# Altium project volume_knob.PrjPcb
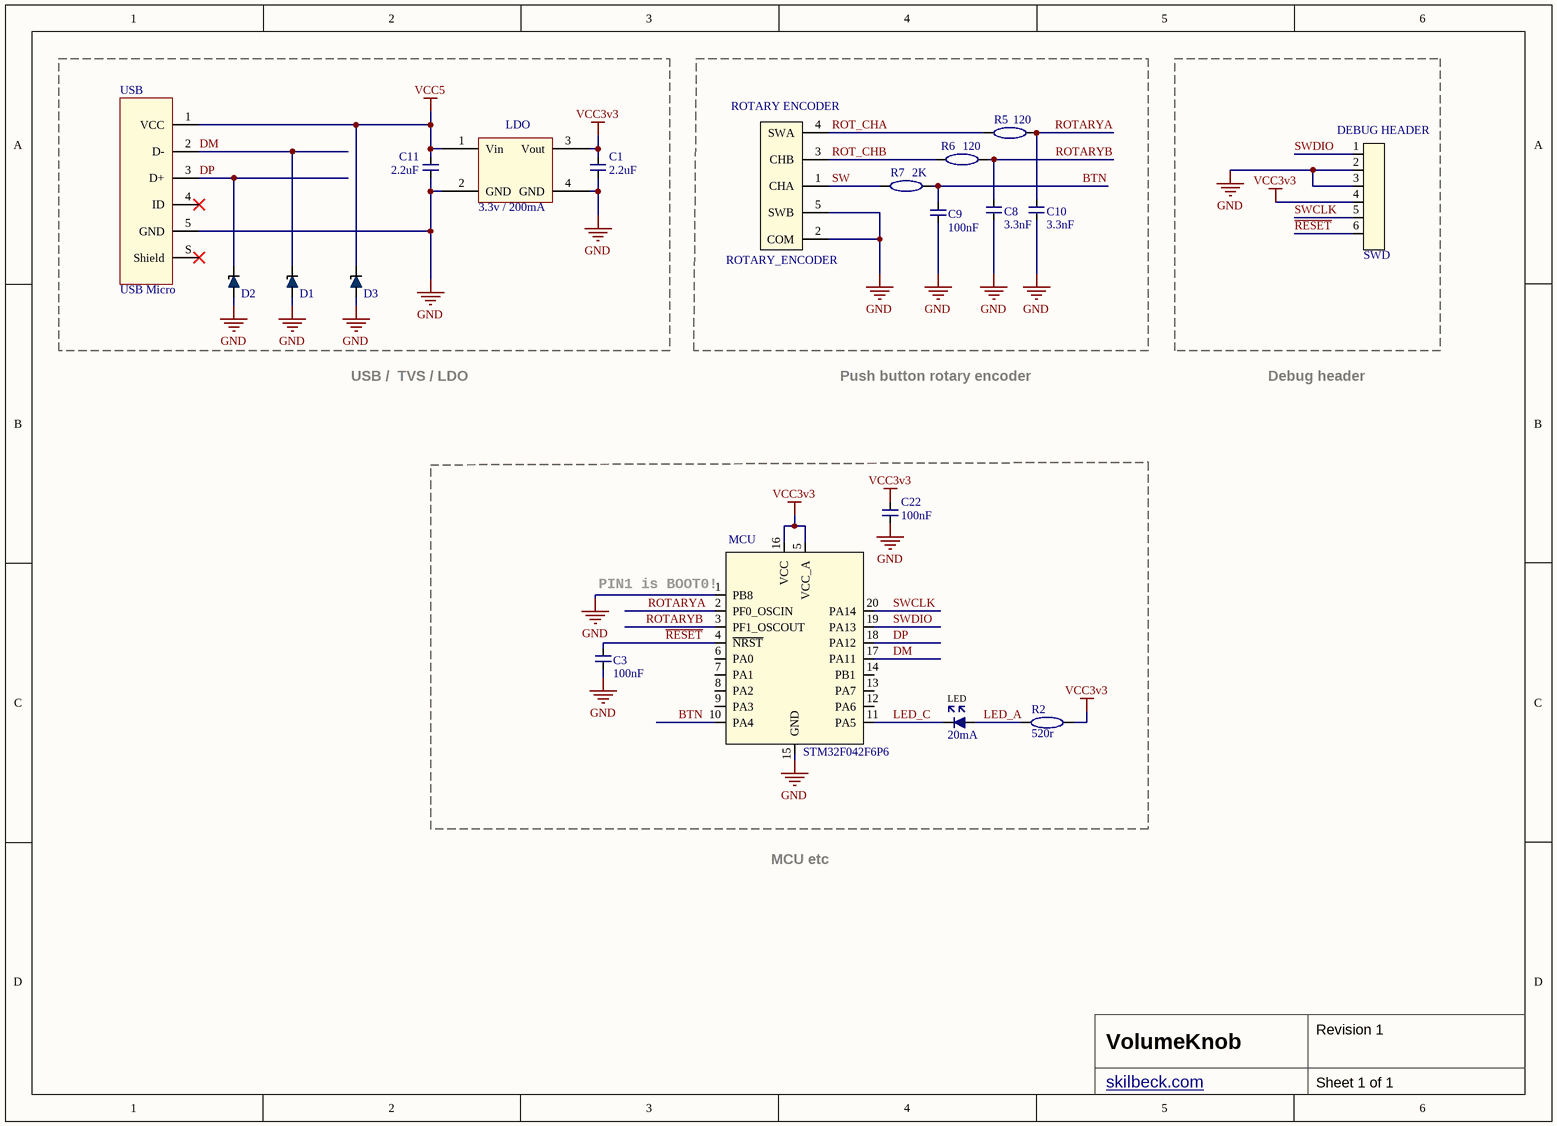
[diagram p0: volume_knob.SchDoc]
1 sheet, 20 parts. Net scope: global (net labels, ports and power ports of the same name join across sheets).
Board file: volume_knob.PcbDoc

## Sheet volume_knob.SchDoc: VolumeKnob
size 290 x 209 mm; Author: skilbeck.com; Revision: 1; SheetNumber: 1; SheetTotal: 1

### Parts
C1  2.2uF  [CAPC1608X07L]
C3  100nF  [CAPC1608X07L]
C8  3.3nF  [CAPC1608X07L]
C9  100nF  [CAPC1608X07L]
C10  3.3nF  [CAPC1608X07L]
C11  2.2uF  [CAPC1608X07L]
C22  100nF  [CAPC1608X07L]
D1  TVS_DIODE  [SODFL98X40-2L]  (value not drawn)
D2  TVS_DIODE  [SODFL98X40-2L]  (value not drawn)
D3  TVS_DIODE  [SODFL98X40-2L]  (value not drawn)
DEBUG_HEADER  SWD  [CON5]  (no BOM)
LDO  3.3v / 200mA  [SOT95P237X110-3L]
LED  20mA  [SMT_LED_0603]
MCU  STM32F042F6P6  [TSOP65P630X120-20L]
R2  520r  [RESC1608X05L]
R5  120  [RESC1608X05L]
R6  120  [RESC1608X05L]
R7  2K  [RESC1608X05L]
ROTARY_ENCODER  ROTARY_ENCODER  [ENCODER]
USB  USB Micro  [USB MICRO B]

### Blocks framed on the sheet
PIN1 is BOOT0!: C3 C22 LED MCU R2

### Nets
GND: C1.1(A) C3.1(A) C8.1(A) C9.1(A) C10.2(B) C11.1(A) C22.1(A) D1.2(A) D2.2(A) D3.2(A) DEBUG_HEADER.2 DEBUG_HEADER.3 LDO.2(GND) LDO.4(GND) MCU.1(PB8) MCU.15(GND) ROTARY_ENCODER.2(COM) ROTARY_ENCODER.5(SWB) USB.5(GND)
VCC3v3: C1.2(B) C22.2(B) DEBUG_HEADER.4 LDO.3(Vout) MCU.5(VCC_A) MCU.16(VCC) R2.2(B)
VCC5: C11.2(B) D3.1(K) LDO.1(Vin) USB.1(VCC)
~{RESET}: C3.2(B) DEBUG_HEADER.6 MCU.4(~{NRST})
BTN: C9.2(B) MCU.10(PA4) R7.1(A)
DM: D1.1(K) MCU.17(PA11) USB.2(D-)
DP: D2.1(K) MCU.18(PA12) USB.3(D+)
LED_A: LED.1(CATHODE) R2.1(A)
LED_C: LED.2(ANODE) MCU.11(PA5)
ROT_CHA: R5.1(A) ROTARY_ENCODER.4(SWA)
ROT_CHB: R6.1(A) ROTARY_ENCODER.3(CHB)
ROTARYA: C10.1(A) MCU.2(PF0_OSCIN) R5.2(B)
ROTARYB: C8.2(B) MCU.3(PF1_OSCOUT) R6.2(B)
SW: R7.2(B) ROTARY_ENCODER.1(CHA)
SWCLK: DEBUG_HEADER.5 MCU.20(PA14)
SWDIO: DEBUG_HEADER.1 MCU.19(PA13)

Not connected (* = marked no-connect by the designer): MCU 6(PA0) 7(PA1) 8(PA2) 9(PA3) 12(PA6) 13(PA7) 14(PB1); USB 4(ID)* S(Shield)*

### Notes on the sheet
- USB /  TVS / LDO
- Push button rotary encoder
- Debug header
- MCU etc

### Library data of the parts
C1 C11 C22 = CAP_CERAMIC: MLCC; Notes: Any suitable
  C1 C11: Value: 2.2uF
  C22: Value: 100nF
C3 C8-C10 = CAP_CERAMIC: Ceramic capacitor; Notes: Any suitable
  C3 C9: Value: 100nF
  C8 C10: Value: 3.3nF
D1-D3 = TVS_DIODE: Notes: Any suitable USB TVS diodes; Supplier Part Number 1: C312244
DEBUG_HEADER = SWD: SWD Debug Header
LDO = LDO: pin to pad: 1>3 2>1 3>2 4>1; Notes: Or similar; Supplier Part Number 1: C479053; Value: 3.3v / 200mA
LED = LED: Notes: Any suitable; Value: 20mA
R2 R5-R7 = RESISTOR: Resistor 1%; Notes: Any suitable 1%
  R2: Value: 520r
  R5 R6: Value: 120
  R7: Value: 2K
ROTARY_ENCODER = ROTARY_ENCODER: Rotary Encoder
USB = USB_SOCKET: USB Receptacle; Supplier Part No. 1: C397452